# Altium project MCORD_SAS_BNC.PrjPcb
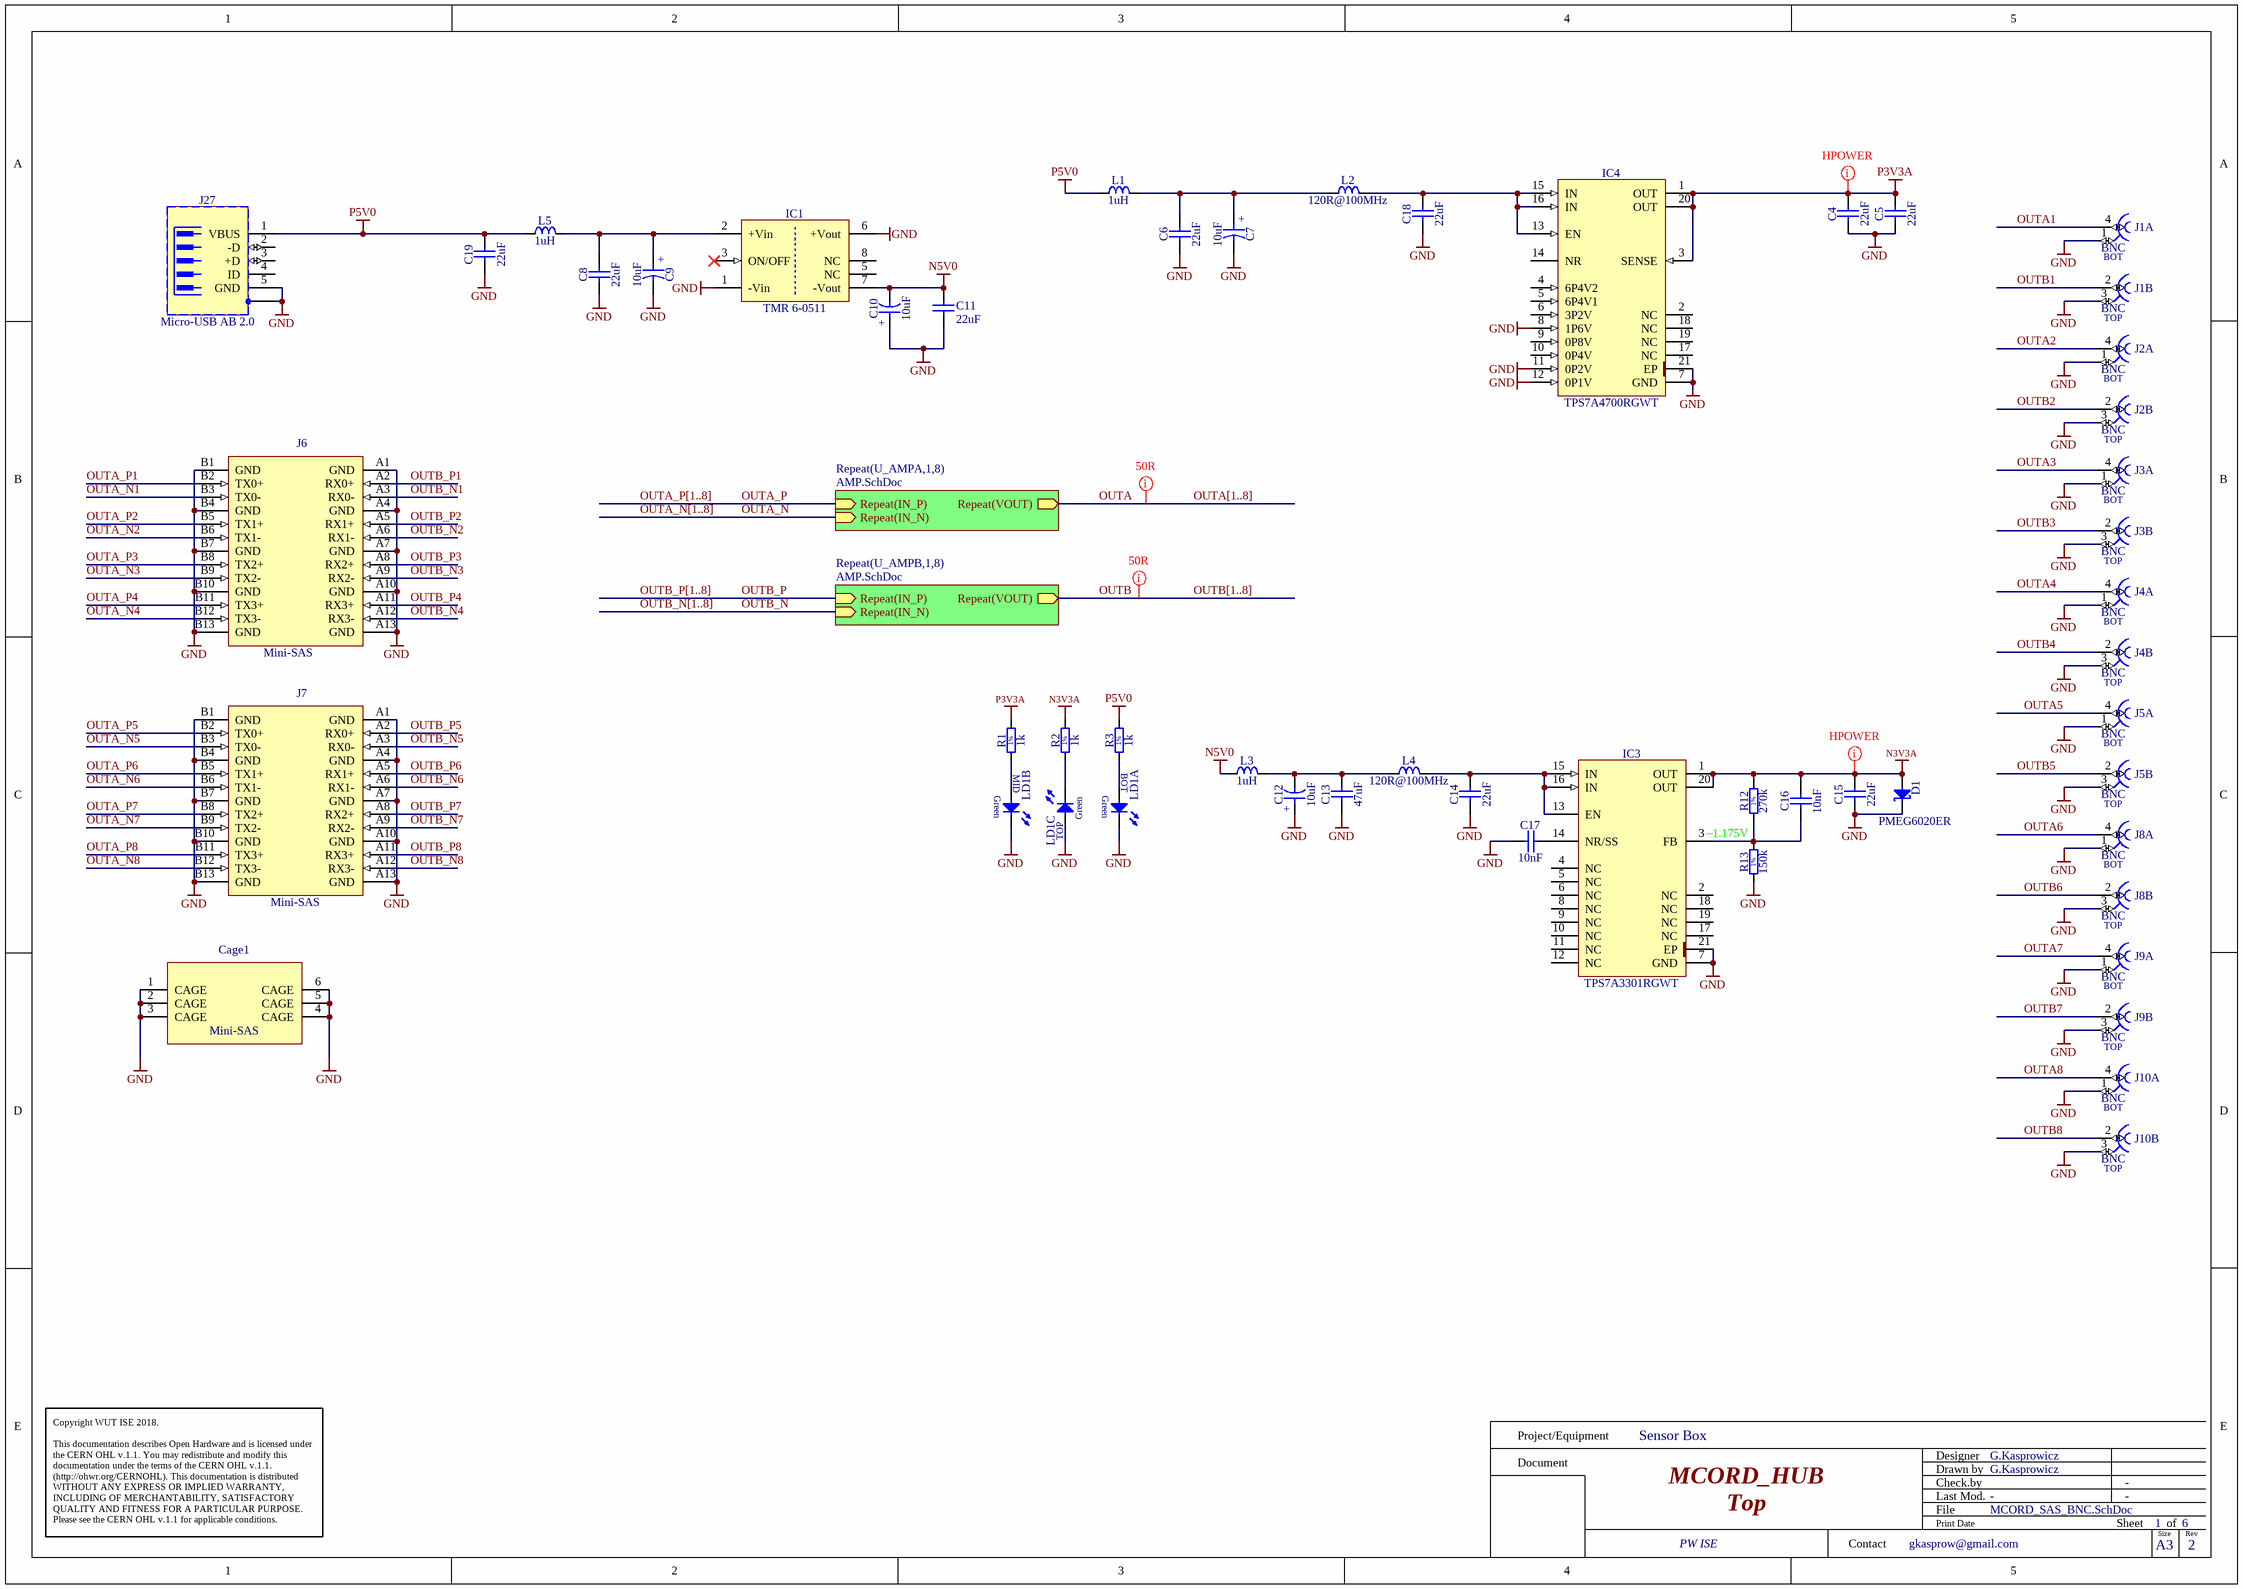
[diagram p0: MCORD_SAS_BNC.SchDoc]
1 sheet, 43 parts. Net scope: hierarchical (ports join the sheet entries above them; power ports are global).
Board file: MCORD_SAS_BNC.PcbDoc

## Sheet MCORD_SAS_BNC.SchDoc: MCORD_HUB
size 420 x 297 mm; Author: G.Kasprowicz; CompanyName: WUT ISE; DrawnBy: G.Kasprowicz; Organization: WUT ISE; Address1: PW ISE; Address2: Nowowiejska 15/19 00-665 Warsaw; Address3: gkasprow@gmail.com; DocumentNumber: 1; Revision: 2; SheetNumber: 1; SheetTotal: 6; ModifiedBy: -; CheckedDate: -; Title2: Top; DivGrp: WUT ISE; Designer: G.Kasprowicz; ModifiedDate: -; ProjectName: Sensor Box

### Parts
C4  22uF  [CAPC2012X135N]
C5  22uF  [CAPC2012X135N]
C6  22uF  [CAPC2012X135N]
C7  10uF  [CAPMP3216X180N]
C8  22uF  [CAPC2012X135N]
C9  10uF  [CAPMP3216X180N]
C10  10uF  [CAPMP3216X180N]
C11  22uF  [CAPC2012X135N]
C12  10uF  [CAPMP3216X180N]
C13  47uF  [CAPC2012X140N]
C14  22uF  [CAPC2012X135N]
C15  22uF  [CAPC2012X135N]
C16  10nF  [CAPC1608X87N]
C17  10nF  [CAPC1608X87N]
C18  22uF  [CAPC2012X135N]
C19  22uF  [CAPC2012X135N]
Cage1  Mini-SAS  [TYCO_1888321-2]
D1  PMEG6020ER  [SODFL3517X110N]
IC1  TMR 6-0511  [DCDC_TRACO_TMR6]
IC3  TPS7A3301RGWT  [QFN65P500X500X100-21N-S325]
IC4  TPS7A4700RGWT  [QFN65P500X500X100-21N-S325]
J1  BNC  [BOMAR_364A2595]  (parts A,B of 2)
J2  BNC  [BOMAR_364A2595]  (parts A,B of 2)
J3  BNC  [BOMAR_364A2595]  (parts A,B of 2)
J4  BNC  [BOMAR_364A2595]  (parts A,B of 2)
J5  BNC  [BOMAR_364A2595]  (parts A,B of 2)
J6  Mini-SAS  [TYCO_1761987-7]
J7  Mini-SAS  [TYCO_1761987-7]
J8  BNC  [BOMAR_364A2595]  (parts A,B of 2)
J9  BNC  [BOMAR_364A2595]  (parts A,B of 2)
J10  BNC  [BOMAR_364A2595]  (parts A,B of 2)
J27  Micro-USB AB 2.0  [HIROSE_ZX62RD-AB-5P8(30)]
L1  1uH  [INDC2620X100N]
L2  120R@100MHz  [INDC1608X65N]
L3  1uH  [INDC2620X100N]
L4  120R@100MHz  [INDC1608X65N]
L5  1uH  [INDC2620X100N]
LD1  Green/Green/Green  [LED_DIALIGHT_570-0100-222F]  (value not drawn)  (parts A,B,C of 3)
R1  1k  [RESC1608X55N]
R2  1k  [RESC1608X55N]
R3  1k  [RESC1608X55N]
R12  270k  [RESC1608X55N]
R13  150k  [RESC1608X55N]

### Sub-sheets
Repeat(U_AMPA,1,8) = AMP.SchDoc (file not in this document): Repeat(IN_P) (in), Repeat(IN_N) (in), Repeat(VOUT) (out)
Repeat(U_AMPB,1,8) = AMP.SchDoc (file not in this document): Repeat(IN_P) (in), Repeat(IN_N) (in), Repeat(VOUT) (out)

### Nets
GND: C4.1 C5.1 C6.1 C7.2 C8.1 C9.2 C10.1 C11.2 C12.1 C13.1 C14.1 C15.1 C17.1 C18.1 C19.1 Cage1.1(CAGE) Cage1.2(CAGE) Cage1.3(CAGE) Cage1.4(CAGE) Cage1.5(CAGE) Cage1.6(CAGE) D1.1(C) IC1.1(-Vin) IC1.6(+Vout) IC3.7(GND) IC3.21(EP) IC4.7(GND) IC4.8(1P6V) IC4.11(0P2V) IC4.12(0P1V) IC4.21(EP) J1.1 J1.3 J2.1 J2.3 J3.1 J3.3 J4.1 J4.3 J5.1 J5.3 J6.A1(GND) J6.A4(GND) J6.A7(GND) J6.A10(GND) J6.A13(GND) J6.B1(GND) J6.B4(GND) J6.B7(GND) J6.B10(GND) J6.B13(GND) J7.A1(GND) J7.A4(GND) J7.A7(GND) J7.A10(GND) J7.A13(GND) J7.B1(GND) J7.B4(GND) J7.B7(GND) J7.B10(GND) J7.B13(GND) J8.1 J8.3 J9.1 J9.3 J10.1 J10.3 J27.5(GND) J27.6(SH) LD1.2(C) LD1.4(C) LD1.5(A) R13.1
N3V3A: C15.2 C16.2 D1.2(A) IC3.1(OUT) IC3.20(OUT) R2.2 R12.2
N5V0: C10.2 C11.1 IC1.7(-Vout) L3.1
P3V3A: C4.2 C5.2 IC4.1(OUT) IC4.3(SENSE) IC4.20(OUT) R1.2
P5V0: C19.2 J27.1(VBUS) L1.1 L5.1 R3.2
OUTA: sheet Repeat(U_AMPA,1,8)/Repeat(VOUT)
OUTA1: J1.4
OUTA2: J2.4
OUTA3: J3.4
OUTA4: J4.4
OUTA5: J5.4
OUTA6: J8.4
OUTA7: J9.4
OUTA8: J10.4
OUTA_N: sheet Repeat(U_AMPA,1,8)/Repeat(IN_N)
OUTA_N1: J6.B3(TX0-)
OUTA_N2: J6.B6(TX1-)
OUTA_N3: J6.B9(TX2-)
OUTA_N4: J6.B12(TX3-)
OUTA_N5: J7.B3(TX0-)
OUTA_N6: J7.B6(TX1-)
OUTA_N7: J7.B9(TX2-)
OUTA_N8: J7.B12(TX3-)
OUTA_P: sheet Repeat(U_AMPA,1,8)/Repeat(IN_P)
OUTA_P1: J6.B2(TX0+)
OUTA_P2: J6.B5(TX1+)
OUTA_P3: J6.B8(TX2+)
OUTA_P4: J6.B11(TX3+)
OUTA_P5: J7.B2(TX0+)
OUTA_P6: J7.B5(TX1+)
OUTA_P7: J7.B8(TX2+)
OUTA_P8: J7.B11(TX3+)
OUTB: sheet Repeat(U_AMPB,1,8)/Repeat(VOUT)
OUTB1: J1.2
OUTB2: J2.2
OUTB3: J3.2
OUTB4: J4.2
OUTB5: J5.2
OUTB6: J8.2
OUTB7: J9.2
OUTB8: J10.2
OUTB_N: sheet Repeat(U_AMPB,1,8)/Repeat(IN_N)
OUTB_N1: J6.A3(RX0-)
OUTB_N2: J6.A6(RX1-)
OUTB_N3: J6.A9(RX2-)
OUTB_N4: J6.A12(RX3-)
OUTB_N5: J7.A3(RX0-)
OUTB_N6: J7.A6(RX1-)
OUTB_N7: J7.A9(RX2-)
OUTB_N8: J7.A12(RX3-)
OUTB_P: sheet Repeat(U_AMPB,1,8)/Repeat(IN_P)
OUTB_P1: J6.A2(RX0+)
OUTB_P2: J6.A5(RX1+)
OUTB_P3: J6.A8(RX2+)
OUTB_P4: J6.A11(RX3+)
OUTB_P5: J7.A2(RX0+)
OUTB_P6: J7.A5(RX1+)
OUTB_P7: J7.A8(RX2+)
OUTB_P8: J7.A11(RX3+)
NetC6_2: C6.2 C7.1 L1.2 L2.1
NetC8_2: C8.2 C9.1 IC1.2(+Vin) L5.2
NetC12_2: C12.2 C13.2 L3.2 L4.1
NetC14_2: C14.2 IC3.13(EN) IC3.15(IN) IC3.16(IN) L4.2
NetC16_1: C16.1 IC3.3(FB) R12.1 R13.2
NetC17_2: C17.2 IC3.14(NR/SS)
NetC18_2: C18.2 IC4.13(EN) IC4.15(IN) IC4.16(IN) L2.2
NetLD1_1: LD1.1(A) R3.1
NetLD1_3: LD1.3(A) R1.1
NetLD1_6: LD1.6(C) R2.1

Not connected (* = marked no-connect by the designer): IC1 3(ON/OFF)* 5(NC) 8(NC); IC3 2(NC) 4(NC) 5(NC) 6(NC) 8(NC) 9(NC) 10(NC) 11(NC) 12(NC) 17(NC) 18(NC) 19(NC); IC4 2(NC) 4(6P4V2) 5(6P4V1) 6(3P2V) 9(0P8V) 10(0P4V) 14(NR) 17(NC) 18(NC) 19(NC); J27 2(-D) 3(+D) 4(ID)

### Buses and harness runs
bus OUTA[1..8]
bus OUTA_N[1..8]
bus OUTA_P[1..8]
bus OUTB[1..8]
bus OUTB_N[1..8]
bus OUTB_P[1..8]

### Layout directives
net class Hpower: N3V3A, P3V3A
net class 50R: OUTA, OUTB

### Notes on the sheet
- –1.175V
- Project/Equipment
- Document
- Designer
- Drawn by
- Check.by
- Copyright WUT ISE 2018.
  This documentation describes Open Hardware and is licensed under the CERN OHL v.1.1. You may redistribute and modify this documentation under the terms of the CERN OHL v.1.1. (http://ohwr.org/CERNOHL). This documentation is distributed WITHOUT ANY EXPRESS OR IMPLIED WARRANTY, INCLUDING OF MERCHANTABILITY, SATISFACTORY QUALITY AND FITNESS FOR A PARTICULAR PURPOSE. Please see the CERN OHL v.1.1 for applicable conditions.
- Contact
- File
- Last Mod.
- Print Date
- Sheet
- Size
- A3
- of
- Rev
- (in symbol BOMAR_364A2595, part A) BOT
- (in symbol BOMAR_364A2595, part B) TOP
- (in symbol CTE3216-18_10UF_10V_10%_LESR1800) +
- (in symbol LED_DIALIGHT_570-0100-222F, part A) BOT; Green
- (in symbol LED_DIALIGHT_570-0100-222F, part B) MID; Green
- (in symbol LED_DIALIGHT_570-0100-222F, part C) Green; TOP
- (in symbol R0603_1K_1%_0.1W_100PPM) 1%
- (in symbol R0603_150K_1%_0.1W_100PPM) 1%
- (in symbol R0603_270K_1%_0.1W_100PPM) 1%

### Library data of the parts
C4-C6 C8 C11 C14 C15 C18 C19 = CC0805_22UF_16V_10%_X5R: Non-polarised capacitor; Part Description: SMD Multilayer Chip Ceramic Capacitor; Manufacturer: GENERIC; Manufacturer1 Part Number: C2012X5R1C226KT; Voltage: 16V; TC: X5R; Tolerance: ±10%; Part Number: CC0805_22UF_16V_10%_X5R; Component Kind: Standard; Component Type: Standard; Pin Count: 2; Value: 22uF; Status: Preferred; Manufacturer Part Number: CC0805_22UF_16V_10%_X5R; Case: 0805; Mounted: Yes; Socket: No; SMD: Yes; Sense: No; Manufacturer1 Example: TDK; Manufacturer1 ComponentHeight: 1.35mm; HelpURL: \\cern.ch\dfs\Applications\Altium\Datasheets\CC0805_X5R_TDK_C.pdf; Author: CERN DEM JLC; CreateDate: 25.10.2012; LatestRevisionDate: 25.10.2012
C7 C9 C10 C12 = CTE3216-18_10UF_10V_10%_LESR1800: Polarised capacitor; Part Description: Low ESR 1R8 Solid Tantalum Chip Capacitor; Manufacturer: GENERIC; Manufacturer1 Part Number: TPSA106K010R1800; Voltage: 10V; Tolerance: ±10%; Part Number: CTE3216-18_10UF_10V_10%_LESR1800; Component Kind: Standard; Component Type: Standard; Pin Count: 2; Value: 10uF; Status: Preferred; Manufacturer Part Number: CTE3216-18_10UF_10V_10%_LESR1800; Case: A; Mounted: Yes; Socket: No; SMD: Yes; Sense: No; Manufacturer1 Example: AVX; Manufacturer1 ComponentHeight: 1.8mm; HelpURL: \\cern.ch\dfs\Applications\Altium\Datasheets\CTE-LESR_AVX_TPS.pdf; Author: CERN DEM JLC; CreateDate: 05.05.2008; LatestRevisionDate: 20.01.2009
C13 = CC0805_47UF_6.3V_20%_X5R: Non-polarised capacitor; Part Description: SMD Multilayer Chip Ceramic Capacitor; Manufacturer: GENERIC; Manufacturer1 Part Number: C0805C476M9PACTU; Voltage: 6.3V; TC: X5R; Tolerance: ±20%; Part Number: CC0805_47UF_6.3V_20%_X5R; Component Kind: Standard; Component Type: Standard; Pin Count: 2; Value: 47uF; Status: Preferred; Manufacturer Part Number: CC0805_47UF_6.3V_20%_X5R; Case: 0805; Mounted: Yes; Socket: No; SMD: Yes; Sense: No; Manufacturer1 Example: KEMET; Manufacturer1 ComponentHeight: 1.4mm; HelpURL: \\cern.ch\dfs\Applications\Altium\Datasheets\CC0805_X5R_KEMET.pdf; Author: CERN DEM JLC; CreateDate: 16.10.2012; LatestRevisionDate: 16.10.2012
C16 C17 = CC0603_10NF_50V_10%_X7R: Non-polarised capacitor; Part Description: SMD Multilayer Chip Ceramic Capacitor; Manufacturer: GENERIC; Manufacturer1 Part Number: 223858615636; Voltage: 50V; TC: X7R; Tolerance: ±10%; Part Number: CC0603_10NF_50V_10%_X7R; Component Kind: Standard; Component Type: Standard; Pin Count: 2; Value: 10nF; Status: Preferred; Manufacturer Part Number: CC0603_10NF_50V_10%_X7R; Case: 0603; Mounted: Yes; Socket: No; SMD: Yes; Sense: No; Manufacturer1 Example: PHYCOMP; Manufacturer1 ComponentHeight: 0.87mm; HelpURL: \\cern.ch\dfs\Applications\Altium\Datasheets\CC0603_X7R_PHYCOMP.pdf; Author: CERN DEM JLC; CreateDate: 03/12/2007; LatestRevisionDate: 03/12/2007
Cage1 = TYCO_1888321-2: Mini-SAS Cage (6Pins); Part Description: Through Hole Dual Port EVERCLEAR Mini-SAS Cage; Manufacturer: TYCO ELECTRONICS; PressFit: No; Part Number: TYCO_1888321-2; Component Kind: Standard; Component Type: Standard; Pin Count: 10; Family: Mini-SAS; Mounted: Yes; Socket: No; SMD: No; Sense: No; Status: None; Manufacturer Part Number: 1888321-2; ComponentHeight: 8.63mm; HelpURL: \\cern.ch\dfs\Applications\Altium\Datasheets\TYCO_1888321-2.pdf; Author: CERN DEM BC; CreateDate: 04.04.2019; LatestRevisionDate: 04.04.2019
D1 = PMEG6020ER: Schottky Diode; Part Description: MEGA Schottky Barrier Rectifier; Manufacturer: NXP SEMICONDUCTORS; Voltage: 60V; Power: 2A; PressFit: No; Bonding: No; Part Number: PMEG6020ER; Component Kind: Standard; Component Type: Standard; Device: PMEG6020ER; PackageDescription: SODFL Diode (SOD123W); 2.60mm W X 1.70mm L X 1.10mm H body, IPC Medium Density; Manufacturer Part Number: PMEG6020ER; Pin Count: 2; Case: SOD123; Mounted: Yes; Socket: No; SMD: Yes; Sense: No; ComponentHeight: 0.65mm; HelpURL: \\cern.ch\dfs\Applications\Altium\Datasheets\PMEG6020ER.pdf; Author: CERN DEM JMW; CreateDate: 19.06.2014; LatestRevisionDate: 19.06.2014
IC1 = TMR 6-0511: TRACO, TMR Series, Single Output DCDC Converter; Part Description: 4.5-9VDC to 5VDC, Iout (max) 1.2A, 6W DC-DC Converter; Manufacturer: TRACO POWER; PressFit: No; Bonding: No; Part Number: TMR 6-0511; Component Kind: Standard; Component Type: Standard; Device: TMR 6-0511; PackageDescription: TMR 6 Series, Body 21.8x9.1mm, Compact SIP-8 Package; Manufacturer Part Number: TMR 6-0511; Pin Count: 7; Mounted: Yes; Socket: No; SMD: No; Sense: No; ComponentHeight: 11.7mm; HelpURL: \\cern.ch\dfs\Applications\Altium\Datasheets\TMR 6-0511.pdf; Author: CERN DEM MR; CreateDate: 08/01/2016; LatestRevisionDate: 24/05/2017
IC3 = TPS7A3301RGWT: -1.18V to -33V -1A, Ultra-Low Noise, High PSRR, Low-Dropout Linear Regulator; Part Description: -1.18V to -33V, -1A, Ultra-Low Noise, High PSRR, Low-Dropout Linear Regulator; Manufacturer: TEXAS INSTRUMENTS; PressFit: No; Bonding: No; Part Number: TPS7A3301RGWT; Component Kind: Standard; Component Type: Standard; Device: TPS7A3301RGWT; PackageDescription: QFN, 0.65mm pitch,square; 20 pin, 5mm X 5mm X 1mm H body (w/thermal tab 3.25 X 3.25mm),  IPC Medium Density; Manufacturer Part Number: TPS7A3301RGWT; Pin Count: 21; Case: QFN20; Mounted: Yes; Socket: No; SMD: Yes; Sense: No; ComponentHeight: 1mm; HelpURL: \\cern.ch\dfs\Applications\Altium\Datasheets\TPS7A3301RGWT.pdf; Author: CERN DEM JLC; CreateDate: 03/07/2012; LatestRevisionDate: 03/07/2012
IC4 = TPS7A4700RGWT: Low Noise (3uVrms), 1A, High Voltage Low-Dropout Linear Regulator; Part Description: 1.4V to 19.1V, 1A, Low Noise (3.5uVrms), Low-Dropout Linear Regulator; Manufacturer: TEXAS INSTRUMENTS; PressFit: No; Bonding: No; Part Number: TPS7A4700RGWT; Component Kind: Standard; Component Type: Standard; Device: TPS7A4700RGWT; PackageDescription: QFN, 0.65mm pitch,square; 20 pin, 5mm X 5mm X 1mm H body (w/thermal tab 3.25 X 3.25mm),  IPC Medium Density; Manufacturer Part Number: TPS7A4700RGWT; Pin Count: 21; Case: QFN20; Mounted: Yes; Socket: No; SMD: Yes; Sense: No; ComponentHeight: 1mm; HelpURL: \\cern.ch\dfs\Applications\Altium\Datasheets\TPS7A4700RGWT.pdf; Author: CERN DEM JLC; CreateDate: 03/07/2012; LatestRevisionDate: 03/07/2012
J1-J5 J8-J10 = BOMAR_364A2595: Dual Right Angle 50 Ohm BNC Jack, White Valox Case; Manufacturer: BOMAR INTERCONNECT; PressFit: No; Part Number: BOMAR_364A2595; Component Kind: Standard; Component Type: Standard; Pin Count: 6; Family: BNC; Mounted: Yes; Socket: No; SMD: No; Sense: No; Status: None; Part Description: Dual Right Angle 50 Ohm BNC Jack, White Valox Case; Manufacturer Part Number: 364A2595; ComponentHeight: 29.3mm; HelpURL: \\cern.ch\dfs\Applications\Altium\Datasheets\BOMAR_364A2595.pdf; Author: CERN DEM JLC; CreateDate: 09/04/2013; LatestRevisionDate: 09/04/2013
J6 J7 = TYCO_1761987-7: 26 Position Mini-Sas Connector (Quad Small Form-Factor SFF-8088); Part Description: Surface Mount EVERCLEAR Mini-SAS Right Angle Receptacle (Quad Small Form-Factor SFF-8088); Manufacturer: TYCO ELECTRONICS; PressFit: No; Part Number: TYCO_1761987-7; Component Kind: Standard; Component Type: Standard; Pin Count: 26; Family: Mini-SAS; Mounted: Yes; Socket: No; SMD: Yes; Sense: No; Status: None; Manufacturer Part Number: 1761987-7; ComponentHeight: 5.55mm; HelpURL: \\cern.ch\dfs\Applications\Altium\Datasheets\TYCO_1761987-7.pdf; Author: CERN DEM MR; CreateDate: 24.04.2019; LatestRevisionDate: 24.04.2019
J27 = HIROSE_ZX62RD-AB-5P8(30): 5 Pin + 1 Shield USB Receptacle; Part Description: Micro-USB 2.0 Right Angle, SMD Type AB - Reverse (Top mount), Shell Through Hole; Manufacturer: HIROSE (HRS); PressFit: No; Part Number: HIROSE_ZX62RD-AB-5P8(30); Component Kind: Standard; Component Type: Standard; Pin Count: 7; Family: Micro-USB AB 2.0; Mounted: Yes; Socket: No; SMD: Yes; Sense: No; Status: None; Manufacturer Part Number: ZX62RD-AB-5P8(30); ComponentHeight: 2.35mm; HelpURL: \\cern.ch\dfs\Applications\Altium\Datasheets\HIROSE_ZX62RD-AB-5P8(30).pdf; ComponentLink1URL: \\cern.ch\dfs\Applications\Altium\Datasheets\HIROSE_ZX62RD-AB-5P8(30)_Package-Drawing.pdf; ComponentLink1Description: Package-Drawing; Author: CERN DEM JMW; CreateDate: 22.06.2017; LatestRevisionDate: 22.06.2017
L1 L3 L5 = IND1008_1UH_20%_WURTH_74479787210B: Inductor; Part Description: Power Multilayer Inductor (WE-PMI Series); Manufacturer: WURTH ELEKTRONIK; Power: 1.95A; Resistance: 0.06R; Tolerance: ±20%; Part Number: IND1008_1UH_20%_WURTH_74479787210B; Component Kind: Standard; Component Type: Standard; Pin Count: 2; Value: 1uH; Status: None; Manufacturer Part Number: 74479787210B; Mounted: Yes; Socket: No; SMD: Yes; Sense: No; ComponentHeight: 1mm; HelpURL: \\cern.ch\dfs\Applications\Altium\Datasheets\IND_WURTH_WE-PMI_74479787210B.pdf; Author: CERN DEM JLC; CreateDate: 01.10.2014; LatestRevisionDate: 01.10.2014; Case: 1008
L2 L4 = IND0603_MURATA_BLM18SG121TN1D: Inductor; Part Description: SMD EMIFIL Suppression Chip Ferrite Bead; Manufacturer: MURATA; Power: 3A; Resistance: 0.025R; Tolerance: ±25%; Part Number: IND0603_MURATA_BLM18SG121TN1D; Component Kind: Standard; Component Type: Standard; Pin Count: 2; Value: 120R@100MHz; Status: None; Manufacturer Part Number: BLM18SG121TN1D; Case: 0603; Mounted: Yes; Socket: No; SMD: Yes; Sense: No; ComponentHeight: 0.65mm; HelpURL: \\cern.ch\dfs\Applications\Altium\Datasheets\IND0603_MURATA_BLM18S.pdf; Author: CERN DEM JLC; CreateDate: 23.07.2014; LatestRevisionDate: 23.07.2014
LD1 = LED_DIALIGHT_570-0100-222F: LED x3 Green LED; Part Description: Triple 2mm Green Diffused LEDs CBI®; PressFit: No; Bonding: No; Part Number: LED_DIALIGHT_570-0100-222F; Component Kind: Standard; Component Type: Standard; Color: Green/Green/Green; PackageDescription: 3x Green LED 2mm PCB Edge Mounting DIALIGHT 570 Serie; Manufacturer: DIALIGHT; Manufacturer Part Number: 570-0100-222F; Pin Count: 6; Mounted: Yes; Socket: No; SMD: No; Sense: No; ComponentHeight: 10.41mm; HelpURL: \\cern.ch\dfs\Applications\Altium\Datasheets\LED_DIALIGHT_570-0100-222F.pdf; Author: CERN DEM JLC; CreateDate: 21/02/2011; LatestRevisionDate: 21/02/2011
R1-R3 = R0603_1K_1%_0.1W_100PPM: Resistor - 1%; Part Description: General Purpose Thick Film Chip Resistor; Manufacturer: GENERIC; Manufacturer1 Part Number: NRC06F1001TRF; Power: 0.1W; TC: ±100ppm/°C; PressFit: No; Part Number: R0603_1K_1%_0.1W_100PPM; Component Kind: Standard; Component Type: Standard; Pin Count: 2; Value: 1k; Status: Preferred; Tolerance: ±1%; Manufacturer Part Number: R0603_1K_1%_0.1W_100PPM; Case: 0603; Mounted: Yes; Sense: No; Socket: No; SMD: Yes; Manufacturer1 Example: NIC COMPONENT; Manufacturer1 ComponentHeight: 0.55mm; HelpURL: \\cern.ch\dfs\Applications\Altium\Datasheets\R0603_NIC_NRC.pdf; Author: CERN DEM JLC; CreateDate: 03/12/2007; LatestRevisionDate: 13/03/2008
R12 = R0603_270K_1%_0.1W_100PPM: Resistor - 1%; Part Description: General Purpose Thick Film Chip Resistor; Manufacturer: GENERIC; Manufacturer1 Part Number: NRC06F2703TRF; Power: 0.1W; TC: ±100ppm/°C; PressFit: No; Part Number: R0603_270K_1%_0.1W_100PPM; Component Kind: Standard; Component Type: Standard; Pin Count: 2; Value: 270k; Status: Preferred; Tolerance: ±1%; Manufacturer Part Number: R0603_270K_1%_0.1W_100PPM; Case: 0603; Mounted: Yes; Sense: No; Socket: No; SMD: Yes; Manufacturer1 Example: NIC COMPONENT; Manufacturer1 ComponentHeight: 0.55mm; HelpURL: \\cern.ch\dfs\Applications\Altium\Datasheets\R0603_NIC_NRC.pdf; Author: CERN DEM JLC; CreateDate: 03/12/2007; LatestRevisionDate: 13/03/2008
R13 = R0603_150K_1%_0.1W_100PPM: Resistor - 1%; Part Description: General Purpose Thick Film Chip Resistor; Manufacturer: GENERIC; Manufacturer1 Part Number: NRC06F1503TRF; Power: 0.1W; TC: ±100ppm/°C; PressFit: No; Part Number: R0603_150K_1%_0.1W_100PPM; Component Kind: Standard; Component Type: Standard; Pin Count: 2; Value: 150k; Status: Preferred; Tolerance: ±1%; Manufacturer Part Number: R0603_150K_1%_0.1W_100PPM; Case: 0603; Mounted: Yes; Sense: No; Socket: No; SMD: Yes; Manufacturer1 Example: NIC COMPONENT; Manufacturer1 ComponentHeight: 0.55mm; HelpURL: \\cern.ch\dfs\Applications\Altium\Datasheets\R0603_NIC_NRC.pdf; Author: CERN DEM JLC; CreateDate: 03/12/2007; LatestRevisionDate: 13/03/2008